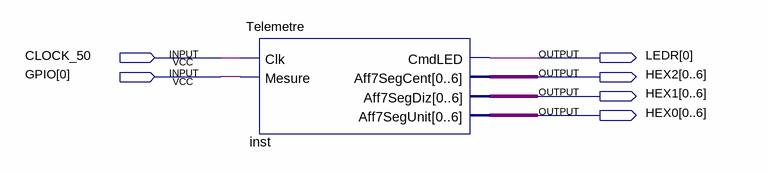
[diagram p0: schematic sheet]
// Quartus schematic Telemetre_Schematics.bdf as structural Verilog: 1 symbols, 6 pins
module Telemetre_Schematics (
  input  CLOCK_50,
  input  [0:0] GPIO,
  output [0:0] LEDR,
  output [0:6] HEX2,
  output [0:6] HEX1,
  output [0:6] HEX0
);

  Telemetre inst (
    .Clk(CLOCK_50), .Mesure(GPIO[0]), .CmdLED(LEDR[0]), .Aff7SegCent(HEX2), .Aff7SegDiz(HEX1),
    .Aff7SegUnit(HEX0));
endmodule
